# EAGLE board Dashboard rev7 (EAGLE 9.6.2)
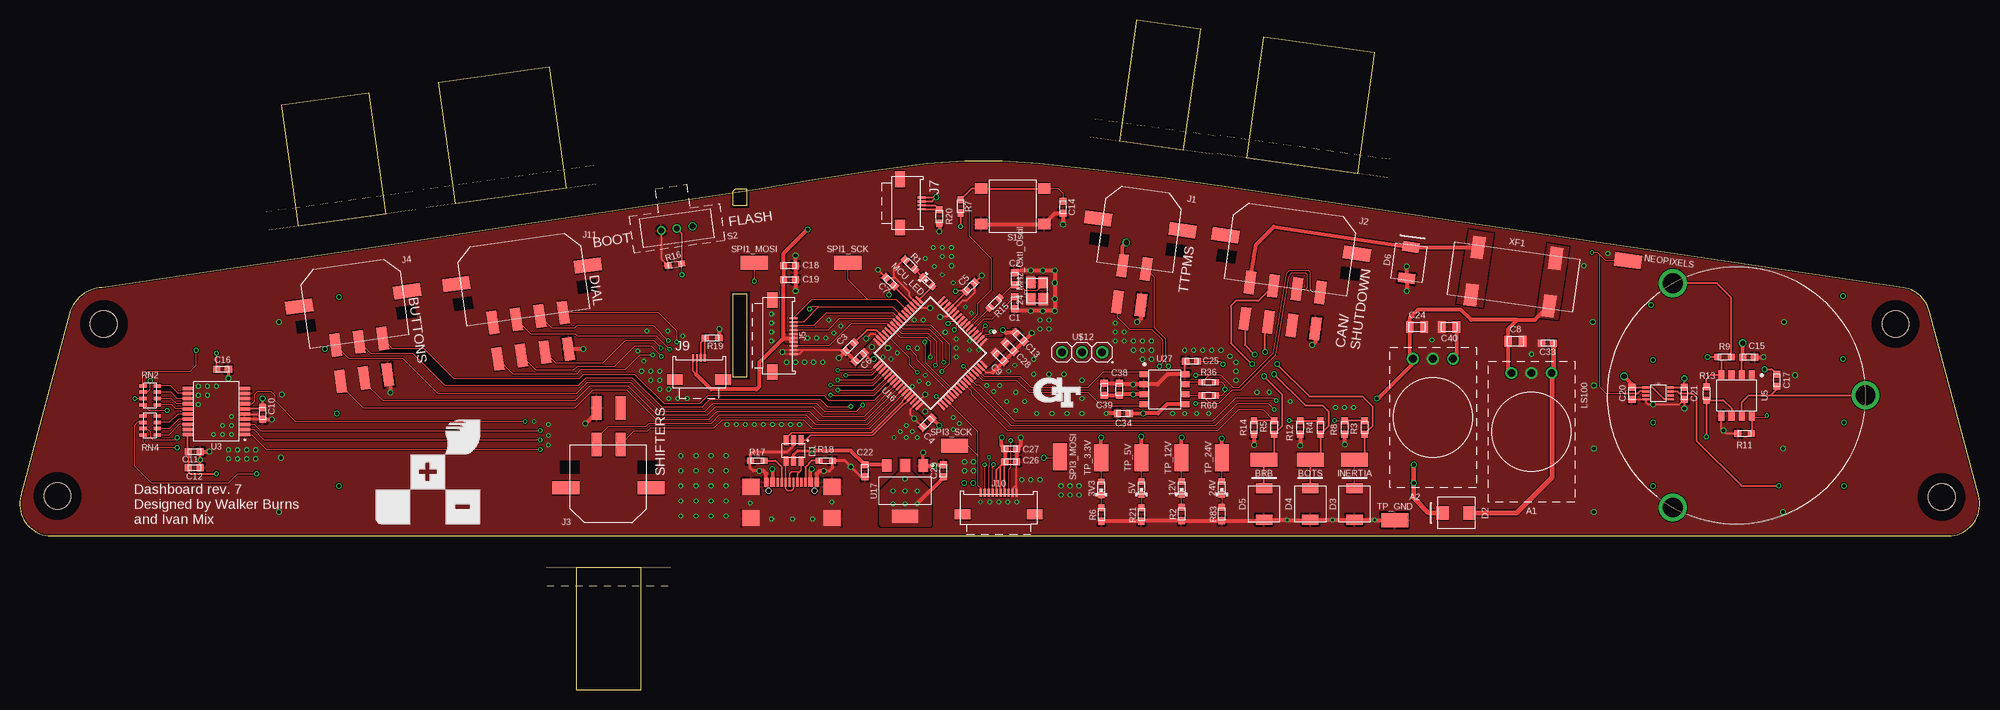
[diagram p5: board, top side]
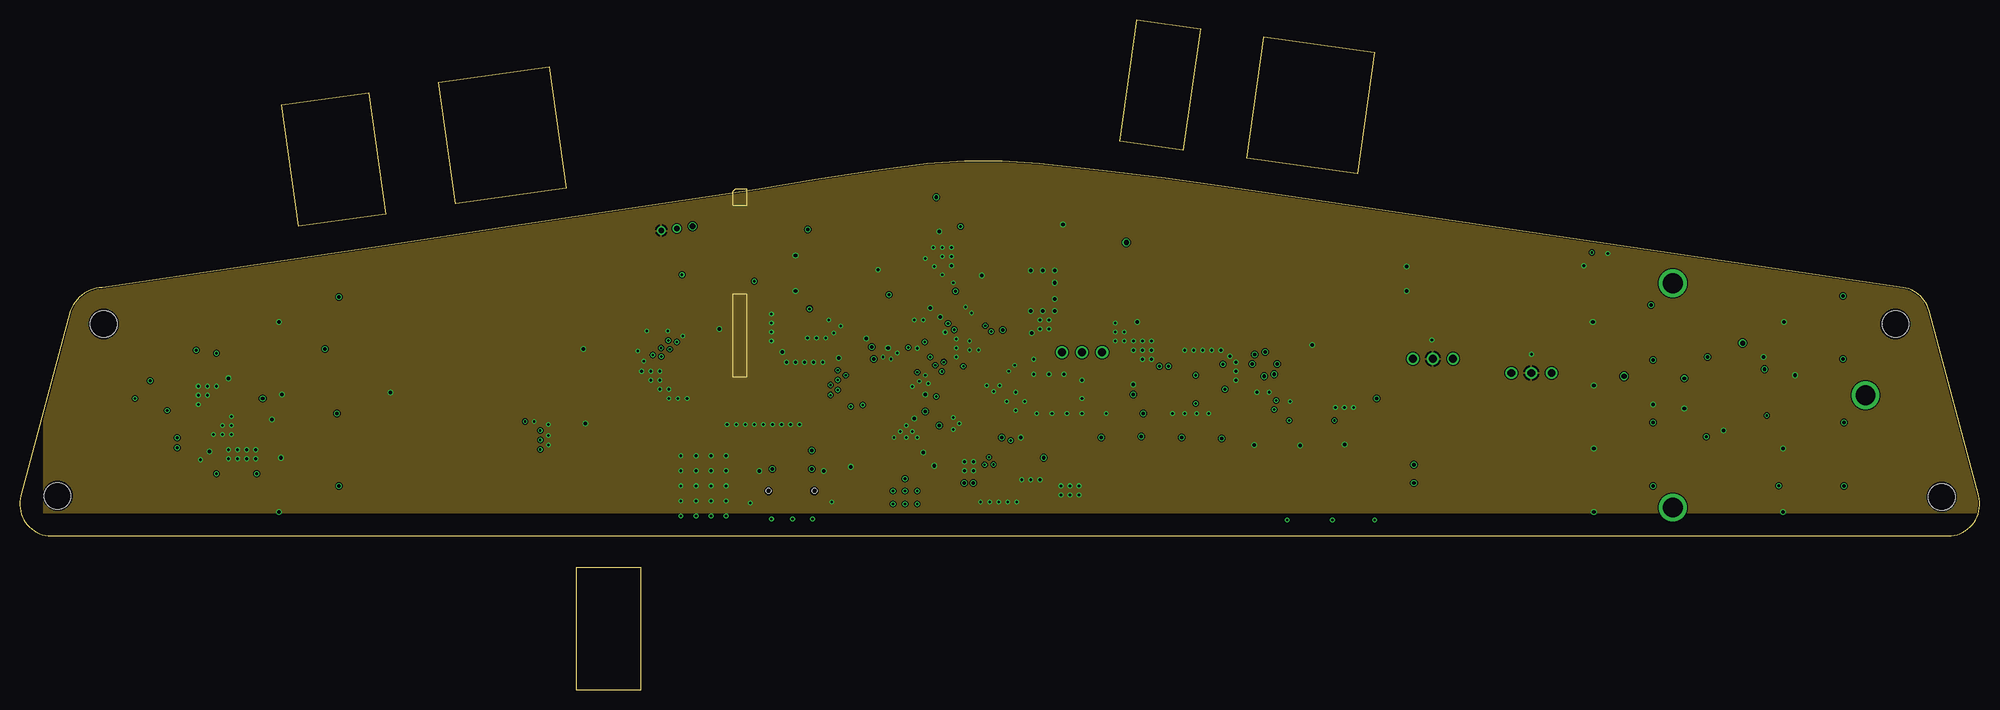
[diagram p6: board, inner layer Route2]
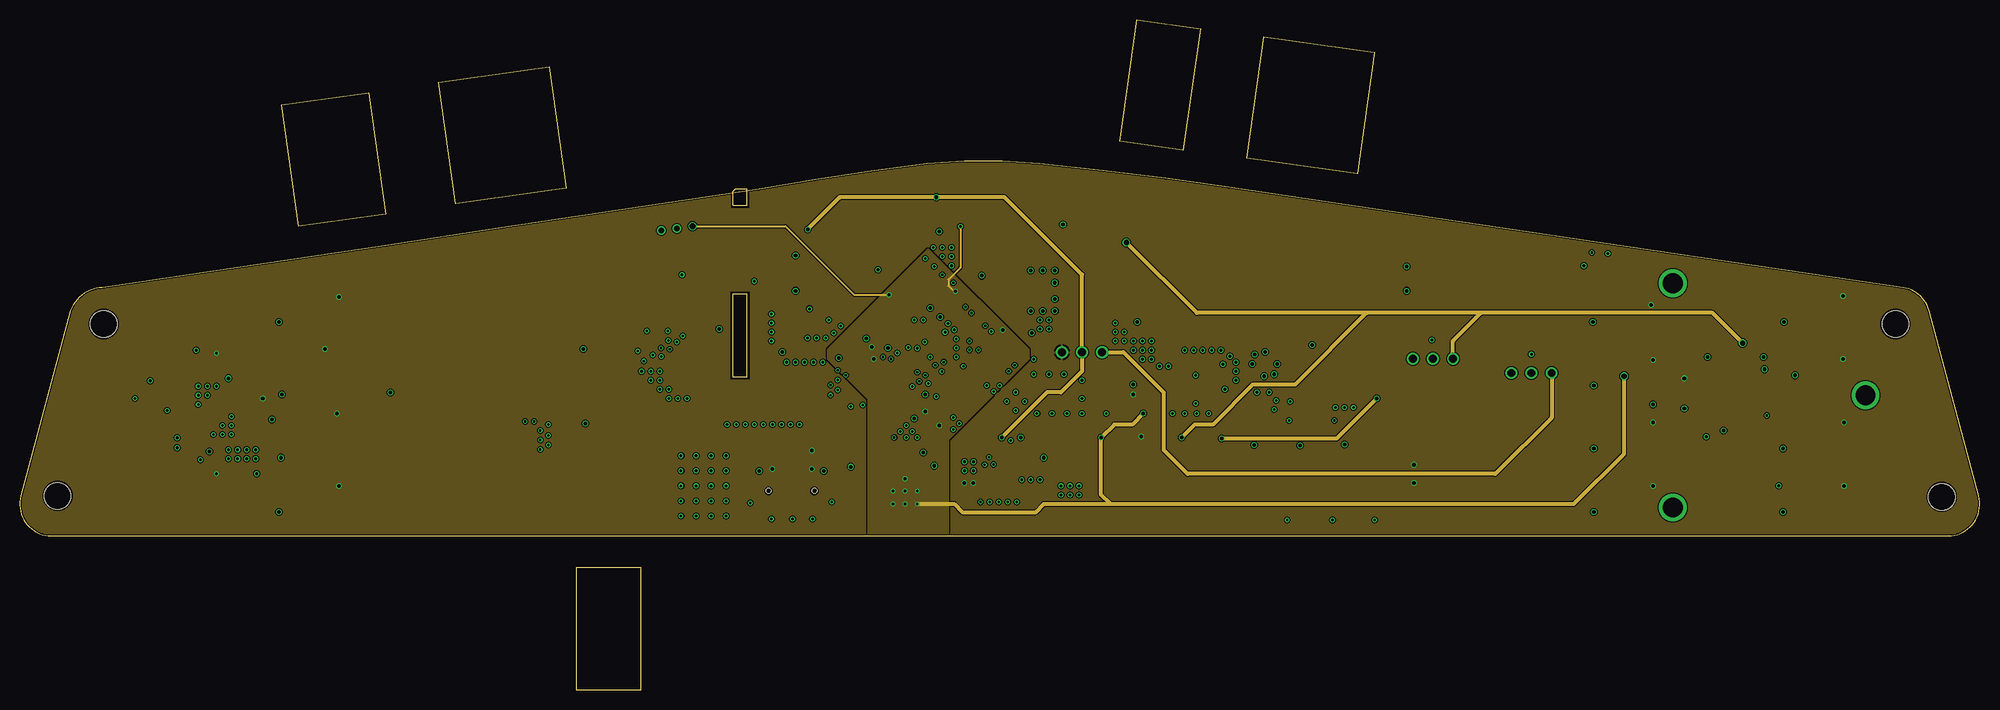
[diagram p7: board, inner layer Route15]
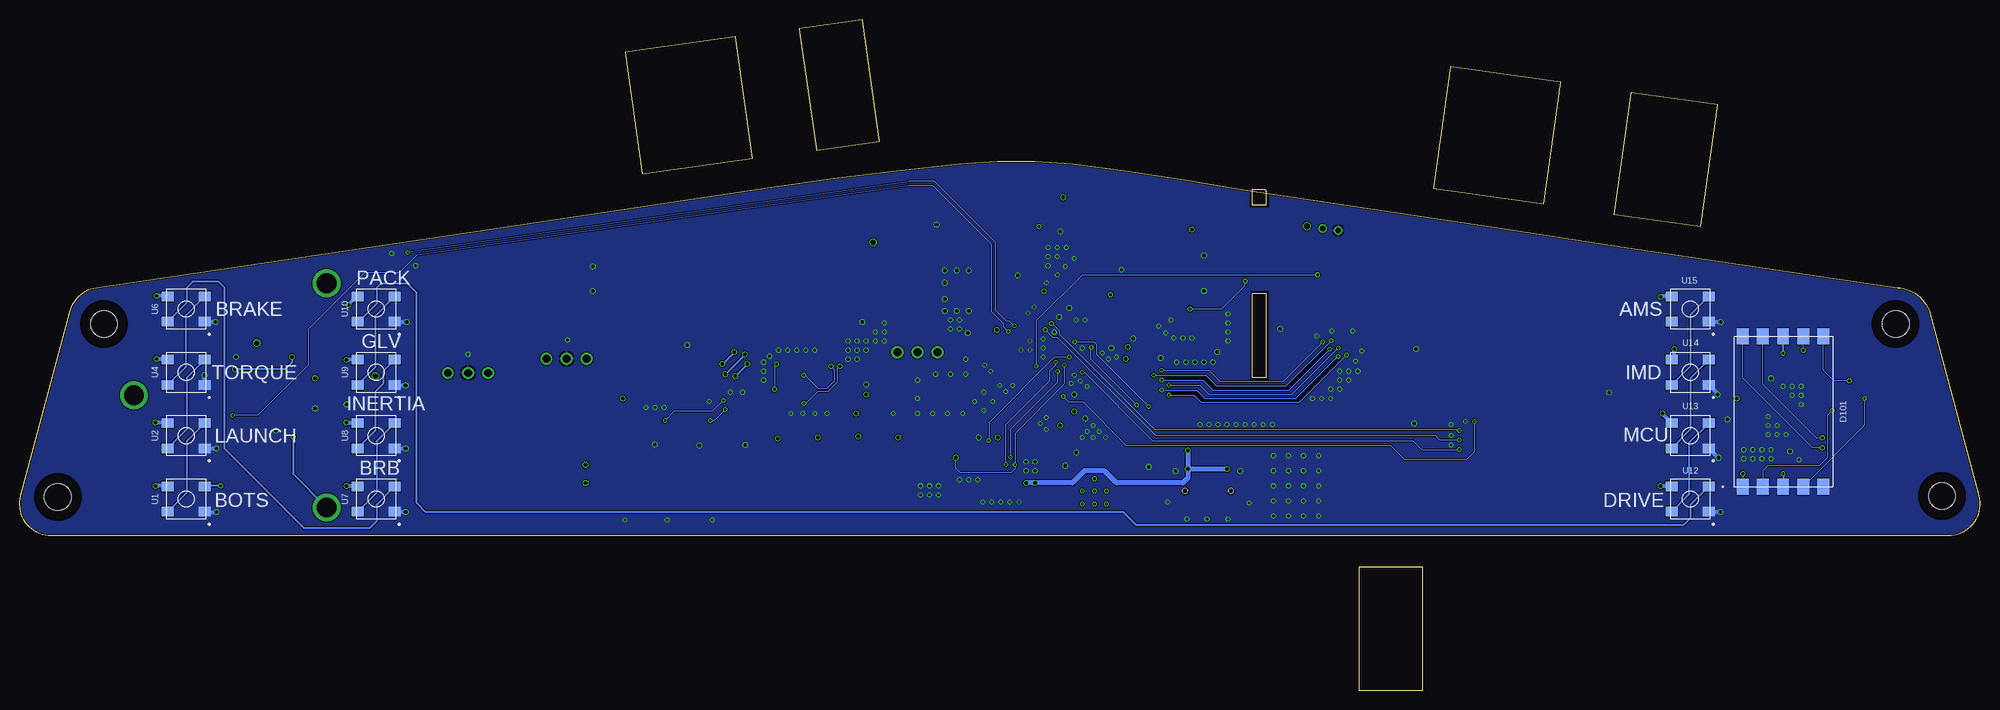
[diagram p8: board, bottom side, seen from below]

Size 247.57 x 47.33 mm. Coordinates in mm from the lower left corner, seen from the top.
Outline: 46.18,36.66 10.44,31.35 arc67 6.4,28.43 0.13,5.04 arc105 4,0 243.57,0 arc105 247.44,5.04 241.17,28.43 arc67 237.89,31.35 202.15,36.66 185.18,39.18 152.68,44.01 arc3 128.83,47.01 arc12 114.62,47 arc3 93.37,43.76 60.87,38.93 46.18,36.66
Copper layers (1+2*15+16): Top 0.035mm / dielectric 0.2mm / Route2 0.0175mm / dielectric 1.065mm / Route15 0.0175mm / dielectric 0.2mm / Bottom 0.035mm
Design rules "JLCPCB (4 Layer)": minimum track width 5mil, minimum drill 0.2mm, track to track 5mil, track to pad 5mil, pad to pad 5mil, via to via 20mil, smd to smd 5mil, copper to edge 0.2mm, drill to drill 21mil, minimum pad ring 6mil, minimum via ring 5mil, stop-mask expansion 2mil, vias tented up to drill 30mil, thermal gap 10mil
Milling: 9 lines

## Footprints (pad centres in the part's own frame; a part is rotated, then mirrored left to right if it is on the bottom)
0603-LED = smd 0.8 x 0.8: 1 -0.825,0; 2 0.825,0
OKI-78SR(HORIZONTAL) = drill 1: 1 2.54,-7.399; 2 0,-7.399; 3 -2.54,-7.399
5015 = smd 3.429 x 1.778: 1 0,0
0603-CAP = smd 0.9 x 0.9: 1 -0.75,0; 2 0.75,0
0805-CAP = smd 0.95 x 1.4: 1 -0.925,0; 2 0.925,0
SOT-23-6 = smd 0.62 x 1.22: 1 -0.95,-1.31; 2 0,-1.31; 3 0.95,-1.31; 4 0.95,1.31; 5 0,1.31; 6 -0.95,1.31
DO-214BA = smd 1.52 x 1.68: 1 -1.7,0; 2 1.7,0
DO-214AA = smd 1.27 x 2.1: 1 -1.98,0; 2 1.98,0
DSM7T = smd 1.5 x 2: 1 -5.08,-9.5; 2 -2.54,-9.5; 3 0,-9.5; 4 2.54,-9.5; 5 5.08,-9.5; 6 5.08,9.5; 7 2.54,9.5; 8 0,9.5; 9 -2.54,9.5; 10 -5.08,9.5
MOLEX_MICROFIT_SMD_RIGHTANGLE_04_DUAL = smd 1.27 x 2.921: 1 1.5,5.474; 2 -1.5,5.474; 3 1.5,10.097; 4 -1.5,10.097 | smd 3.429 x 1.651: PAD1 5.386,0; PAD2 -5.386,0
MOLEX_MICROFIT_SMD_RIGHTANGLE_08_DUAL = smd 1.27 x 2.921: 1 4.5,5.474; 2 1.5,5.474; 3 -1.5,5.474; 4 -4.5,5.474; 5 4.5,10.097; 6 1.5,10.097; 7 -1.5,10.097; 8 -4.5,10.097 | smd 3.429 x 1.651: PAD1 8.386,0; PAD2 -8.386,0
MOLEX_MICROFIT_SMD_RIGHTANGLE_06_DUAL = smd 1.27 x 2.921: 1 3,5.474; 2 0,5.474; 3 -3,5.474; 4 3,10.097; 5 0,10.097; 6 -3,10.097 | smd 3.429 x 1.651: PAD1 6.886,0; PAD2 -6.886,0
5051101092 = smd 2 x 1.3: 1 -4.55,-0.65; 2 4.55,-0.65 | smd 0.3 x 1: 3 -2.25,2.05; 4 -1.75,2.05; 5 -1.25,2.05; 6 -0.75,2.05; 7 -0.25,2.05; 8 0.25,2.05; 9 0.75,2.05; 10 1.25,2.05; 11 1.75,2.05; 12 2.25,2.05
5051100492 = smd 0.3 x 1: 1 -0.75,2.05; 2 -0.25,2.05; 3 0.25,2.05; 4 0.75,2.05 | smd 2 x 1.3: P1 -3.05,-0.65; P2 3.05,-0.65
USB4110 = smd 0.6 x 1.15: P$1 -3.2,0.6; P$2 -2.4,0.6; P$11 2.4,0.6; P$12 3.2,0.6 | smd 0.3 x 1.15: P$3 -1.75,0.6; P$4 -1.25,0.6; P$5 -0.75,0.6; P$6 -0.25,0.6; P$7 0.25,0.6; P$8 0.75,0.6; P$9 1.25,0.6; P$10 1.75,0.6 | smd 2.18 x 2: S$1 -5.11,0; S$2 5.11,0; S$3 -5.11,-3.93; S$4 5.11,-3.93 | hole 0.65: -2.89,-0.5; 2.89,-0.5
CPT-3011C-120 = drill 2.5: F 14.162,8.051; G -14.162,8.051; M 0,-16.29
0603-RES = smd 0.9 x 0.8: 1 -0.85,0; 2 0.85,0
1206-RES-ARRAY = smd 0.45 x 0.9: 1 -1.2,-0.9; 2 -0.4,-0.9; 3 0.4,-0.9; 4 1.2,-0.9; 5 1.2,0.9; 6 0.4,0.9; 7 -0.4,0.9; 8 -1.2,0.9
B3S-100X = smd 1.55 x 1.3: 1 3.975,-2.25; 2 -3.975,-2.25; 3 3.975,2.25; 4 -3.975,2.25
SSSS916400 = drill 0.7: 1 -2,0; 2 2,0; COM 0,0
NEOPIXEL = smd 1.5 x 1.2: 1 -2.35,1.6; 2 -2.35,-1.6; 3 2.35,-1.6; 4 2.35,1.6
SSOP-20 = smd 0.45 x 1.37: 1 -2.925,-3.6; 2 -2.275,-3.6; 3 -1.625,-3.6; 4 -0.975,-3.6; 5 -0.325,-3.6; 6 0.325,-3.6; 7 0.975,-3.6; 8 1.625,-3.6; 9 2.275,-3.6; 10 2.925,-3.6; 11 2.925,3.6; 12 2.275,3.6; 13 1.625,3.6; 14 0.975,3.6; 15 0.325,3.6; 16 -0.325,3.6; 17 -0.975,3.6; 18 -1.625,3.6; 19 -2.275,3.6; 20 -2.925,3.6
SOIC-08(NARROW,0.15") = smd 0.762 x 1.143: 1 -1.905,-2.603; 2 -0.635,-2.603; 3 0.635,-2.603; 4 1.905,-2.603; 5 1.905,2.603; 6 0.635,2.603; 7 -0.635,2.603; 8 -1.905,2.603
STM32-FOOTPRINT = smd 0.3 x 1.2: P$1 -3.75,-5.75; P$2 -3.25,-5.75; P$3 -2.75,-5.75; P$4 -2.25,-5.75; P$5 -1.75,-5.75; P$6 -1.25,-5.75; P$7 -0.75,-5.75; P$8 -0.25,-5.75; P$9 0.25,-5.75; P$10 0.75,-5.75; P$11 1.25,-5.75; P$12 1.75,-5.75; P$13 2.25,-5.75; P$14 2.75,-5.75; P$15 3.25,-5.75; P$16 3.75,-5.75; P$33 3.75,5.75; P$34 3.25,5.75; P$35 2.75,5.75; P$36 2.25,5.75; P$37 1.75,5.75; P$38 1.25,5.75; P$39 0.75,5.75; P$40 0.25,5.75; P$41 -0.25,5.75; P$42 -0.75,5.75; P$43 -1.25,5.75; P$44 -1.75,5.75; P$45 -2.25,5.75; P$46 -2.75,5.75; P$47 -3.25,5.75; P$48 -3.75,5.75 | smd 1.2 x 0.3: P$17 5.75,-3.75; P$18 5.75,-3.25; P$19 5.75,-2.75; P$20 5.75,-2.25; P$21 5.75,-1.75; P$22 5.75,-1.25; P$23 5.75,-0.75; P$24 5.75,-0.25; P$25 5.75,0.25; P$26 5.75,0.75; P$27 5.75,1.25; P$28 5.75,1.75; P$29 5.75,2.25; P$30 5.75,2.75; P$31 5.75,3.25; P$32 5.75,3.75; P$49 -5.75,3.75; P$50 -5.75,3.25; P$51 -5.75,2.75; P$52 -5.75,2.25; P$53 -5.75,1.75; P$54 -5.75,1.25; P$55 -5.75,0.75; P$56 -5.75,0.25; P$57 -5.75,-0.25; P$58 -5.75,-0.75; P$59 -5.75,-1.25; P$60 -5.75,-1.75; P$61 -5.75,-2.25; P$62 -5.75,-2.75; P$63 -5.75,-3.25; P$64 -5.75,-3.75
SOT-223 = smd 1.2 x 1.6: 1 -2.3,-3.2; 2 0,-3.2; 3 2.3,-3.2 | smd 3.3 x 1.6: 4 0,3.2
8-VSSOP = smd 0.85 x 0.3: 1 -1.55,0.75; 2 -1.55,0.25; 3 -1.55,-0.25; 4 -1.55,-0.75; 5 1.55,-0.75; 6 1.55,-0.25; 7 1.55,0.25; 8 1.55,0.75
MOUNTING_M3 = hole 3.4: 0,0
1X03 = drill 1.016: 1 1.27,-1.27; 2 3.81,-1.27; 3 6.35,-1.27
24_MHZ_XTAL_OSCILLATOR = smd 1.5 x 1.2: 1 -1.05,0.8; 2 1.05,0.8; 3 1.05,-0.8; 4 -1.05,-0.8
3588 = smd 1.575 x 2.819: 1 -4.953,3.035; 2 -4.953,-3.035; 3 4.953,-3.035; 4 4.953,3.035

## Placement (x,y rotation side)
3V3  LED_0603_GREEN_2V2  [0603-LED]  136.6,6 90 top
5V  LED_0603_BLUE  [0603-LED]  141.68,6.06 90 top
12V  LED_0603_RED  [0603-LED]  146.76,6.06 90 top
24V  LED_0603_ORANGE  [0603-LED]  151.84,6.06 90 top
A1  VOLTAGE_REGULATOR_MODULE__5V  [OKI-78SR(HORIZONTAL)]  190.96,13.17 180 top
A2  VOLTAGE_REGULATOR_MODULE__12V  [OKI-78SR(HORIZONTAL)]  178.51,14.95 180 top
BOTS  TEST_POINT  [5015]  163.02,9.61 0 top
BRB  TEST_POINT  [5015]  157.17,9.61 0 top
C1  CAPACITOR_0603_10V_15PF  [0603-CAP]  125.68,29.42 270 top
C2  CAPACITOR_0603_10V_15PF  [0603-CAP]  125.68,32.47 90 top
C3  CAPACITOR_0603_10V_4.7UF  [0603-CAP]  104.85,23.84 225 top
C4  CAPACITOR_0603_10V_0.1UF  [0603-CAP]  114.63,14.31 225 top
C5  CAPACITOR_0603_10V_0.1UF  [0603-CAP]  120.09,31.45 45 top
C6  CAPACITOR_0603_10V_0.1UF  [0603-CAP]  106.12,22.56 225 top
C7  CAPACITOR_0603_10V_0.1UF  [0603-CAP]  109.93,32.09 135 top
C8  CAPACITOR_0805_50V_10UF  [0805-CAP]  188.92,24.6 0 top
C9  CAPACITOR_0603_10V_0.1UF  [0603-CAP]  123.77,22.56 315 top
C10  CAPACITOR_0603_10V_0.1UF  [0603-CAP]  30.68,15.45 270 top
C11  CAPACITOR_0603_10V_0.1UF  [0603-CAP]  22.05,10.63 0 top
C12  CAPACITOR_0603_10V_0.1UF  [0603-CAP]  22.05,8.59 0 top
C13  CAPACITOR_0603_10V_1UF  [0603-CAP]  126.31,25.11 315 top
C14  CAPACITOR_0603_10V_0.1UF  [0603-CAP]  131.77,41.49 270 top
C15  CAPACITOR_0603_25V_0.1UF  [0603-CAP]  218.39,22.56 180 top
C16  CAPACITOR_0603_10V_0.1UF  [0603-CAP]  25.6,21.04 0 top
C17  CAPACITOR_0603_25V_1.2NF  [0603-CAP]  221.94,19.64 90 top
C18  CAPACITOR_0603_10V_0.1UF  [0603-CAP]  97.23,34.12 0 top
C19  CAPACITOR_0603_10V_0.1UF  [0603-CAP]  97.23,32.34 0 top
C20  CAPACITOR_0603_10V_0.1UF  [0603-CAP]  203.66,17.99 90 top
C21  CAPACITOR_0603_10V_0.1UF  [0603-CAP]  210.26,17.99 270 top
C22  CAPACITOR_0603_10V_4.7UF  [0603-CAP]  106.75,8.21 270 top
C24  CAPACITOR_0805_50V_10UF  [0805-CAP]  176.48,26.38 0 top
C25  CAPACITOR_0603_10V_4.7NF  [0603-CAP]  148.03,22.06 0 top
C26  CAPACITOR_0603_10V_0.1UF  [0603-CAP]  125.17,9.36 0 top
C27  CAPACITOR_0603_10V_0.1UF  [0603-CAP]  125.17,11.01 0 top
C28  CAPACITOR_0603_10V_0.1UF  [0603-CAP]  125.04,23.84 315 top
C29  CAPACITOR_0603_10V_4.7UF  [0603-CAP]  116.66,8.21 90 top
C33  CAPACITOR_0603_25V_10UF  [0603-CAP]  192.99,24.34 180 top
C34  CAPACITOR_0603_10V_0.1UF  [0603-CAP]  139.39,15.45 0 top
C38  CAPACITOR_0603_10V_0.1UF  [0603-CAP]  138.89,18.5 270 top
C39  CAPACITOR_0603_10V_1UF  [0603-CAP]  136.98,18.5 270 top
C40  CAPACITOR_0805_50V_10UF  [0805-CAP]  180.54,26.38 180 top
D1  USBLC6-2SC6  [SOT-23-6]  97.74,10.75 180 top
D2  SCHOTTKY__15V  [DO-214BA]  181.43,2.88 180 top
D3  TVS_DO-214AA_30V  [DO-214AA]  168.6,4.02 90 top
D4  TVS_DO-214AA_30V  [DO-214AA]  163.02,4.02 90 top
D5  TVS_DO-214AA_30V  [DO-214AA]  157.17,4.02 90 top
D6  TVS_DO-214AA_30V  [DO-214AA]  175.46,34.5 82 top
D101  LED_7_SEGMENT_BLUE_DSM7TA  [DSM7T]  24.84,15.71 0 bottom
INERTIA  TEST_POINT  [5015]  168.6,9.61 0 top
J1  CONNECTOR-4_μF_S_RA_  [MOLEX_MICROFIT_SMD_RIGHTANGLE_04_DUAL]  141.55,39.33 172 top
J2  CONNECTOR-8_μF_S_RA_  [MOLEX_MICROFIT_SMD_RIGHTANGLE_08_DUAL]  160.6,36.79 172 top
J3  CONNECTOR-4_μF_S_RA_  [MOLEX_MICROFIT_SMD_RIGHTANGLE_04_DUAL]  74.37,6.06 0 top
J4  CONNECTOR-6_μF_S_RA_  [MOLEX_MICROFIT_SMD_RIGHTANGLE_06_DUAL]  42.11,29.93 188 top
J5  CONNECTOR-10__  [5051101092]  95.71,25.23 270 top
J7  CONNECTOR-4_FD19_0492_  [5051100492]  111.83,42 270 top
J8  USB4110  [USB4110]  97.48,6.18 0 top
J9  CONNECTOR-4_FD19_0492_  [5051100492]  85.8,20.41 0 top
J10  CONNECTOR-10__  [5051101092]  123.65,3.39 0 top
J11  CONNECTOR-8_μF_S_RA_  [MOLEX_MICROFIT_SMD_RIGHTANGLE_08_DUAL]  63.45,32.98 188 top
LS100  BUZZER_3_PIN_CPT-3011C-120  [CPT-3011C-120]  216.86,17.74 90 top
MCU_LED  LED_0603_GREEN_2V2  [0603-LED]  114.68,32.09 315 top
NEOPIXELS  TEST_POINT  [5015]  203.15,34.76 352 top
R1  RESISTOR_0603_240  [0603-RES]  112.47,34.25 315 top
R2  RESISTOR_0603_1K  [0603-RES]  146.76,2.75 90 top
R3  RESISTOR_0603_41.2K  [0603-RES]  169.87,13.67 90 top
R4  RESISTOR_0603_41.2K  [0603-RES]  164.29,13.67 90 top
R5  RESISTOR_0603_41.2K  [0603-RES]  158.44,13.67 90 top
R6  RESISTOR_0603_240  [0603-RES]  136.63,2.68 90 top
R7  RESISTOR_0603_10K  [0603-RES]  118.82,41.62 270 top
R8  RESISTOR_0603_5.1K  [0603-RES]  167.33,13.67 270 top
R9  RESISTOR_0603_150K  [0603-RES]  215.34,22.56 0 top
R11  RESISTOR_0603_10K  [0603-RES]  217.88,12.91 0 top
R12  RESISTOR_0603_5.1K  [0603-RES]  161.75,13.67 270 top
R13  RESISTOR_0603_1.5M  [0603-RES]  213.05,17.99 90 top
R14  RESISTOR_0603_5.1K  [0603-RES]  155.9,13.67 270 top
R15  RESISTOR_0603_0  [0603-RES]  123.14,29.42 225 top
R16  RESISTOR_0603_10K  [0603-RES]  82.75,34.25 8 top
R17  RESISTOR_0603_5.1K  [0603-RES]  93.17,9.48 0 top
R18  RESISTOR_0603_5.1K  [0603-RES]  101.8,9.48 180 top
R19  RESISTOR_0603_30  [0603-RES]  87.45,24.98 180 top
R20  RESISTOR_0603_30  [0603-RES]  116.15,40.34 90 top
R21  RESISTOR_0603_180  [0603-RES]  141.68,2.68 90 top
R36  RESISTOR_0603_60.4  [0603-RES]  150.19,19.39 180 top
R60  RESISTOR_0603_60.4  [0603-RES]  150.19,17.74 180 top
R83  RESISTOR_0603_3.3K  [0603-RES]  151.84,2.75 90 top
RN2  RESISTOR_NETWORK_4_160  [1206-RES-ARRAY]  16.46,17.74 90 top
RN4  RESISTOR_NETWORK_4_160  [1206-RES-ARRAY]  16.46,13.93 90 top
S1  BUTTON  [B3S-100X]  125.42,41.62 180 top
S2  SWITCH_SPDT_SSSS916400  [SSSS916400]  83.01,38.82 188 top
SPI1_MOSI  TEST_POINT  [5015]  92.78,34.5 0 top
SPI1_SCK  TEST_POINT  [5015]  104.6,34.5 0 top
SPI3_MOSI  TEST_POINT  [5015]  131.39,9.99 270 top
SPI3_SCK  TEST_POINT  [5015]  118.06,11.39 0 top
TP_3.3V  TEST_POINT  [5015]  136.6,9.86 90 top
TP_5V  TEST_POINT  [5015]  141.68,9.86 90 top
TP_12V  TEST_POINT  [5015]  146.76,9.86 90 top
TP_24V  TEST_POINT  [5015]  151.84,9.86 90 top
TP_GND  TEST_POINT  [5015]  173.68,1.99 0 top
U1  NEOPIXEL_IN-PI55QATPRPGPBPW-40  [NEOPIXEL]  226.56,4.65 0 bottom
U2  NEOPIXEL_IN-PI55QATPRPGPBPW-40  [NEOPIXEL]  226.56,12.65 0 bottom
U3  MCP23S08  [SSOP-20]  24.84,15.71 90 top
U4  NEOPIXEL_IN-PI55QATPRPGPBPW-40  [NEOPIXEL]  226.56,20.65 0 bottom
U5  RE46C100  [SOIC-08(NARROW,0.15")]  216.86,17.74 180 top
U6  NEOPIXEL_IN-PI55QATPRPGPBPW-40  [NEOPIXEL]  226.56,28.65 0 bottom
U7  NEOPIXEL_IN-PI55QATPRPGPBPW-40  [NEOPIXEL]  202.56,4.65 0 bottom
U8  NEOPIXEL_IN-PI55QATPRPGPBPW-40  [NEOPIXEL]  202.56,12.65 0 bottom
U9  NEOPIXEL_IN-PI55QATPRPGPBPW-40  [NEOPIXEL]  202.56,20.65 0 bottom
U10  NEOPIXEL_IN-PI55QATPRPGPBPW-40  [NEOPIXEL]  202.56,28.65 0 bottom
U12  NEOPIXEL_IN-PI55QATPRPGPBPW-40  [NEOPIXEL]  36.56,4.65 0 bottom
U13  NEOPIXEL_IN-PI55QATPRPGPBPW-40  [NEOPIXEL]  36.56,12.65 0 bottom
U14  NEOPIXEL_IN-PI55QATPRPGPBPW-40  [NEOPIXEL]  36.56,20.65 0 bottom
U15  NEOPIXEL_IN-PI55QATPRPGPBPW-40  [NEOPIXEL]  36.56,28.65 0 bottom
U16  STM32-LQFP64  [STM32-FOOTPRINT]  115.01,23.07 135 top
U17  VOLTAGE_REGULATOR_SOT-223_3.3V  [SOT-223]  111.83,5.67 180 top
U27  TCAN1051HQV-Q1  [SOIC-08(NARROW,0.15")]  144.6,18.5 270 top
U$5  [LOGO_HYTECH_SQUARE_EXTRA_LARGE]  51.51,8.09 0 top
U$6  SN74LXC2T45DCUR  [8-VSSOP]  206.96,17.99 0 top
U$7  [LOGO_GT_SMALL]  131.01,18.12 0 top
U$8  [MOUNTING_M3]  242.77,4.91 0 top
U$9  [MOUNTING_M3]  10.62,26.76 0 top
U$10  [MOUNTING_M3]  236.93,26.76 0 top
U$11  [MOUNTING_M3]  4.77,5.04 0 top
U$12  JUMPER_3PIN  [1X03]  138,21.93 180 top
X1  24_MHZ_XTAL_OSCILLATOR  [24_MHZ_XTAL_OSCILLATOR]  128.47,30.95 90 top
XF1  FUSE_HOLDER_MINIBLADESMD  [3588]  188.67,32.73 352 top

## Tracks (layer width: path | path; a pad name or v marks a point on that pad's centre or on a via)
5V_IN
  Top 0.635: C33.1 193.74,20.81 A1.3 193.5,7.33 189.05,2.88 D2.1
  Route15 0.508: A1.3 193.5,14.95 186.38,7.83 147.52,7.83 144.47,10.88 144.47,18.12 139.39,23.2 U$12.1
7SEG_LOAD  (via drill 0.3)
  Top 0.152: U3.7 29.37,16.68 29.67,16.98 29.67,17.87 30.05,18.25 31.7,18.25 32.21,17.74 32.21,17.1 34.87,14.44 v63.83,14.44 | v115.77,17.61 116.67,16.71 U16.P$50
  Bottom 0.152: v115.77,17.61 115.01,16.85 113.23,16.85 107.77,11.39 74.37,11.39 72.59,9.61 64.84,9.61 63.83,10.63 v63.83,14.44
24VIN
  Top 0.508: J2.1 156.15,36.78 158.41,39.04 D6.2 184.14,36.46 XF1.1
  pour Top (no thermals): 181.81,30.57 183.08,38.69 186.13,38.19 184.73,28.79 181.56,29.3
+3V3  (via drill 0.35, 0.45, 0.65)
  Top 0.152: TP_3.3V.1 3V3.2
  Top 0.254: C6.1 107.42,22.32 v107.89,22.32 | U16.P$19 110.46,31.51 C7.1 110.42,31.56 109.8,30.95 v109.8,30.44 | U16.P$13 119.56,30.8 C5.1 118.23,30.92 v118.18,30.88 | U$6.5 207.71,17.24 206.2,18.75 205.42,18.75 U$6.1 C20.2 | R7.2 v118.82,39.08
  Top 0.508: C4.1 115.24,14.84 v116.15,13.93 | C20.2 203.64,18.75 203.64,19.14 203.66,19.15 v202.66,20.15 | TP_3.3V.1 v136.6,12.41 | U27.5 144.92,16.6 143.78,15.45 v141.93,15.45 C34.2 | C13.1 124.51,25.63 v124.15,25.99 | C29.1 116.66,7.33 v113.36,4.02
  Route15 0.254: S2.1 96.72,39.1 105.38,30.44 v109.8,30.44 | v118.82,39.08 118.82,33.87 117.3,32.34 117.3,31.58 118,30.88 v118.18,30.88
  Route15 0.508: v113.36,4.02 118.06,4.02 119.07,3.01 128.34,3.01 129.36,4.02 137.74,4.02 | 137.74,4.02 196.29,4.02 202.66,10.39 v202.66,20.15 | 137.74,4.02 136.6,5.17 v136.6,12.41 138.25,14.06 140.54,14.06 v141.93,15.45
  other vias: 110.31,5.67 111.83,5.67 111.83,7.2 111.83,4.02 110.31,4.02 114.37,15.71 107.64,23.84 113.36,5.67
  pour Top (no thermals): 111.07,9.74 111.07,8.09 108.53,5.55 108.53,1.48 108.79,1.23 115.01,1.23 115.14,1.36 115.14,5.55 112.6,8.09 112.6,9.74
  pour Route15: 107.14,-5.63 107.14,17.23 102.06,22.31 102.06,23.58 114.76,36.28 127.46,23.58 127.46,22.31 117.3,12.15 117.3,-5.63
  pour Top (no thermals): 113.99,16.72 115.77,14.95 115.77,14.82 115.26,14.31 115.14,14.31 113.49,15.96 113.23,15.96
  pour Top (no thermals): 107.9,24.85 106.12,23.07 106.63,22.56 107.14,22.56 108.66,24.09
  pour Top (no thermals): 121.87,23.45 121.23,24.09 122.12,24.98 124.28,24.98 125.55,26.25 125.93,26.25 126.44,25.74 126.44,25.49 122.12,21.17 121.36,21.93 121.36,22.06 121.87,22.56
+5V  (via drill 0.35, 0.45)
  Top 0.152: 24.85,23.06 v24.84,23.07 | C11.1 21.24,10.68 | C10.1 30.51,16.03 | 5V.2 TP_5V.1
  Top 0.254: C16.1 24.85,23.06 | C11.1 C12.1 21.3,8.09 21.55,7.83 v24.84,7.83 | 21.24,10.68 U3.20 | 30.51,16.03 U3.6 | U$6.8 C21.1 v210.26,19.9
  Top 0.381: C10.1 v30.68,17.36 | D1.5 97.74,10.25 98.25,10.75 v100.02,10.75
  Top 0.508: v95.07,8.47 95.08,8.45 J8.P$2 | J8.P$11 99.88,8.33 v100.02,8.47 | TP_5V.1 v141.68,12.53 | U27.3 v140.66,17.87 139,17.87 C38.2 C39.2 | v100.02,10.75 104.96,10.75 C22.1 109.44,8.96 U17.3
  Top 0.635: D2.2 178,2.88 176.1,4.78 v176.1,6.69 v176.1,8.98
  Bottom 0.254: v24.84,23.07 D101.8 | v24.84,7.83 D101.3
  Bottom 0.508: U6.1 228.97,30.31 v230.33,30.31 | U4.1 228.97,22.31 v230.33,22.31 | U2.1 228.96,14.31 v230.45,14.31 | U1.1 228.96,6.31 v230.45,6.31 | U8.1 206.26,14.25 v206.32,14.31 | U7.1 206.26,6.25 v206.32,6.31 | U9.1 206.26,22.25 v206.32,22.18 | U10.1 204.99,30.25 v206.07,29.17 | U12.1 40.28,6.25 v40.33,6.31 | U13.1 40.08,15.42 v40.08,15.45 | U14.1 38.56,22.6 v38.56,23.58 | U15.1 40.27,30.25 v40.33,30.19
  Bottom 0.635: v100.02,10.75 v100.02,8.47 | v100.02,8.47 v95.07,8.47 | v100.02,8.47 100.02,7.33 100.66,6.69 109.04,6.69 110.56,8.21 113.1,8.21 114.63,6.69 v119.33,6.69 v120.43,6.69
  pour Route15 (rank 2): -4.62,-5.63 251.92,-5.63 251.92,51.52 -4.62,51.52
  cutout Route15: 89.86,30.82 92.15,30.82 92.15,19.77 89.86,19.77
  cutout Route15: 89.86,44.16 89.86,41.49 92.15,41.49 92.15,44.16
+12V  (via drill 0.45, 0.65)
  Top 0.152: 12V.2 TP_12V.1
  Top 0.254: U5.2 217.5,22.43 C15.2
  Top 0.508: C40.1 181.47,22.76 A2.3 | J1.1 139.31,36.57 v139.77,37.04 | C15.2 217.63,22.58 v217.63,24.34 | TP_12V.1 v146.76,12.41
  Route15 0.508: 184.57,28.15 170.13,28.15 | 170.13,28.15 148.66,28.15 v139.77,37.04 | A2.3 181.05,24.63 184.57,28.15 | v217.63,24.34 213.82,28.15 184.57,28.15 | v146.76,12.41 148.41,14.06 150.7,14.06 155.78,19.14 161.11,19.14 170.13,28.15
+24V  (via drill 0.45)
  Top 0.152: 24V.2 TP_24V.1
  Top 0.508: A1.1 188,20.98 C8.1 188,26.09 189.18,27.26 | v171.4,17.36 171.62,17.36 175.97,21.71 A2.1 175.55,22.76 C24.1 175.55,27.48 176.6,28.53 182.07,28.53 183.34,27.26 189.18,27.26 | TP_24V.1 v151.84,12.28 | 189.18,27.26 191.39,27.26 XF1.3
  Route15 0.508: v171.4,17.36 166.32,12.28 v151.84,12.28
  pour Top (no thermals): 193.88,27.26 191.56,27.57 192.99,36.96 195.65,36.49 194.26,27.26
A  (via drill 0.35)
  Top 0.152: RN2.5 15.56,20.14 16.2,20.79 21.54,20.79 22.3,21.55 v22.3,23.45
  Bottom 0.152: v22.3,23.45 D101.7
A2
  Top 0.152: U3.12 20.02,17.98 19.07,18.94 RN2.4
B  (via drill 0.35)
  Top 0.152: RN2.6 16.1,18.14 16.46,18.5 v16.46,19.59
  Bottom 0.152: D101.6 19.76,20.89 18.46,19.59 v16.46,19.59
B2
  Top 0.152: U3.13 19.91,17.33 19.11,18.14 RN2.3
BOTS  (via drill 0.45)
  Top 0.254: D4.2 163.02,9.48 | 163.02,9.48 BOTS.1 | 163.02,9.48 163.52,9.48 164.29,10.25 R4.1 165.3,13.84 165.3,15.71 164.54,16.47 162.38,16.47 v158.44,20.41 | J2.5 154.74,24.11 v155.97,22.88
  Bottom 0.254: v155.97,22.88 v158.44,20.41
BOTS_READ  (via drill 0.3)
  Top 0.152: U16.P$58 125.21,13.94 151.03,13.94 153.81,16.72 157.69,16.72 v158.44,15.96 | v160.35,14.56 161.71,14.56 R12.1
  Top 0.254: R12.1 R4.2
  Bottom 0.152: v158.44,15.96 159.84,14.56 v160.35,14.56
BRB  (via drill 0.45)
  Top 0.254: D5.2 157.17,9.48 | 157.17,9.48 BRB.1 | 157.17,9.48 157.81,9.48 158.44,10.12 R5.1 159.46,13.84 159.46,17.87 v157.17,20.15 | J2.2 156.45,29.68 153.62,29.68 152.98,29.04 152.98,24.34 v155.65,21.68
  Bottom 0.254: v155.65,21.68 v157.17,20.15
BRB_READ
  Top 0.152: U16.P$57 120.14,18.3 120.14,17.91 124.75,13.31 151.36,13.31 154.02,15.96 157.01,15.96 R5.2
  Top 0.254: R5.2 R14.1
BTN_DIM_READ
  Top 0.152: U16.P$40 106.64,15.06 101.43,15.06 100.28,16.22 87.83,16.22 86.82,15.2 80.59,15.2 76.92,18.87 72,18.87 70.24,17.11 45.82,17.11 43.52,19.41 J4.5
BTN_MC_CYCLE_READ
  Top 0.152: J4.3 47.06,23.71 51.02,23.71 54.82,19.91 70.7,19.91 71.19,20.41 77.69,20.41 81.37,16.72 85.93,16.72 86.94,17.74 101.56,17.74 102.18,17.12 108,17.12 U16.P$39
BTN_MODE_READ  (via drill 0.3)
  Top 0.152: J4.2 44.31,23.07 49.61,23.07 53.67,19.02 70.58,19.02 71.46,19.9 77.43,19.9 81.11,16.22 86.18,16.22 87.2,17.23 101.11,17.23 102.01,16.33 v104.98,16.33 | U16.P$54 114.37,21.94 114.37,24.39 v114.3,24.47
  Bottom 0.152: v104.98,16.33 104.98,16.34 111.52,22.88 111.52,24.15 111.83,24.47 v114.3,24.47
BTN_PRESET_READ
  Top 0.152: U16.P$41 106.86,14.57 100.91,14.57 99.78,15.71 88.09,15.71 87.1,14.72 80.37,14.72 76.71,18.37 72.34,18.37 70.16,16.19 43.34,16.19 40.55,18.99 J4.4
BTN_START_READ  (via drill 0.3)
  Top 0.152: J4.1 41.56,22.44 48.33,22.44 52.77,18 70.33,18 71.72,19.39 77.16,19.39 80.85,15.71 86.56,15.71 87.58,16.72 100.66,16.72 101.73,15.65 105.61,15.65 v106.5,16.54 | U16.P$53 113.37,22.24 113.37,22.68 v112.24,23.81
  Bottom 0.152: v112.24,23.81 112.24,22.29 v106.5,16.54
BUZZER_CTRL  (via drill 0.3)
  Top 0.152: U16.P$2 122.01,25.48 122.41,25.48 v122.71,25.78 | v220.67,15.2 220.42,14.95 218.77,14.95
  Top 0.254: U5.8 218.77,14.95 218.77,12.95 R11.2
  Bottom 0.152: v122.71,25.78 123.28,26.35 123.28,26.74 124.91,28.38 124.91,36.92 132.27,44.28 135.29,44.28 197.38,35.49 199.58,33.3 203.97,33.3 211.15,26.12 211.15,21.55 217.5,15.2 v220.67,15.2
C  (via drill 0.35)
  Top 0.152: RN2.7 14.57,17.34 v14.55,17.36
  Bottom 0.152: v14.55,17.36 14.55,13.95 D101.4
C2
  Top 0.152: U3.14 19.8,16.68 19.14,17.34 RN2.2
CANH  (via drill 0.35)
  Top 0.152: U27.7 147.46,19.39 R36.2 150.23,20.28 | J2.4 163.35,30.74 162.94,31.15 162.94,33.36 162.76,33.54 160.4,33.54 160.08,33.22 160.03,32.91 158.36,23.12 154,18.75 153.24,18.75 151.71,20.28 150.23,20.28 | 150.23,20.28 v148.54,20.28 | v145.11,21.42 144.72,21.81 144.72,24.89 143.35,26.26 143.35,32.63 J1.2
  Bottom 0.152: v148.54,20.28 148.41,20.28 146.76,18.63 145.62,18.63 144.73,19.52 144.73,21.04 v145.11,21.42
CANL  (via drill 0.35)
  Top 0.152: 147.33,17.74 R60.2 150.35,16.72 | 150.35,16.72 151.46,16.72 153.19,18.45 154.25,18.45 158.68,22.87 160.29,32.66 160.6,33.23 162.38,33.23 162.63,32.98 162.63,31.33 162.38,31.07 161.41,31.07 J2.3 | 150.35,16.72 v148.54,16.72 | v143.95,21.42 144.34,21.81 144.34,24.73 143.01,26.06 140.24,26.06 138.66,27.63 J1.3
  Top 0.254: U27.6 147.33,17.74
  Bottom 0.152: v148.54,16.72 148.28,16.72 146.76,18.25 145.48,18.25 144.33,19.4 144.33,21.04 v143.95,21.42
D  (via drill 0.35)
  Top 0.152: RN2.8 16.26,15.83 v18.62,15.83
  Bottom 0.152: v18.62,15.83 19.25,15.2 19.25,9.86 20.27,8.85 26.74,8.85 27.38,8.21 D101.2
D2
  Top 0.152: U3.15 19.69,16.03 19.18,16.54 RN2.1
DIAL_AUTOCROSS  (via drill 0.3)
  Top 0.152: v79.97,22.83 78.32,22.83 76.44,20.95 70.85,20.95 70.31,20.41 62.34,20.41 J11.5 | v102.41,17.76 107.93,17.76 U16.P$38
  Bottom 0.152: v102.41,17.76 99.29,17.76 98.37,16.85 85.96,16.85 v79.97,22.83
DIAL_ENDURANCE  (via drill 0.3)
  Top 0.152: v83.01,24.47 83.01,25.86 80.68,28.19 J11.4 | U16.P$33 107.55,20.91 v103.33,20.91
  Bottom 0.152: v83.01,24.47 87.96,19.52 95.96,19.52 97.36,20.91 v103.33,20.91
DIAL_LAUNCH  (via drill 0.3)
  Top 0.152: v81.01,23.74 80.12,24.63 76.44,24.63 73.61,21.8 67.72,21.8 J11.7 | v102.41,19.03 107.79,19.03 U16.P$36
  Bottom 0.152: v102.41,19.03 98.52,19.03 97.36,17.87 86.88,17.87 v81.01,23.74
DIAL_MODE_1  (via drill 0.3)
  Top 0.152: U16.P$34 107.62,20.28 v104.34,20.28 | v81.92,24.65 80.07,26.5 70.31,26.5 70.05,26.25 67.21,26.25 J11.3
  Bottom 0.152: v104.34,20.28 104.31,20.25 97.72,20.25 96.41,18.94 87.63,18.94 v81.92,24.65
DIAL_MODE_2  (via drill 0.3)
  Top 0.152: v82.1,23.56 80.43,25.23 70.43,25.23 70.18,25.49 64.59,25.49 J11.2 | U16.P$35 107.72,19.67 v103.35,19.67
  Bottom 0.152: v103.35,19.67 98.14,19.67 96.85,18.37 87.28,18.37 v82.1,23.56
DIAL_SKIDPAD  (via drill 0.3)
  Top 0.152: v81.06,22.65 79.79,23.92 77.63,23.92 75.08,21.37 70.38,21.37 69.92,20.91 65.23,20.91 J11.6 | v103.35,18.4 107.86,18.4 U16.P$37
  Bottom 0.152: v103.35,18.4 98.9,18.4 97.86,17.36 86.36,17.36 v81.06,22.65
DISP_5V  (via drill 0.45)
  Top 0.254: J10.7 123.4,8.33 C26.1 | J10.8 123.9,8.83 C26.1 | J10.9 124.4,9.33 C26.1 | J7.1 115.76,42.75 | 115.76,42.75 v115.77,42.76 | J7.2 115.26,42.25 115.76,42.75 | J9.1 85.05,20.77 85.42,20.41 85.55,20.54 J9.2
  Top 0.508: C26.1 C27.1 124.03,11.4 v124.03,12.41 | v99.52,38.69 96.48,35.66 C18.1 C19.1 96.48,24.99 96.47,24.98 | 85.42,20.41 87.32,18.5 93.04,18.5 93.42,18.88 93.42,21.93 96.47,24.98 | 96.47,24.98 J5.8
  Route15 0.508: v124.03,12.41 129.74,18.12 131.52,18.12 134.19,20.79 U$12.2 134.19,32.98 124.41,42.76 v115.77,42.76 103.58,42.76 v99.52,38.69
  pour Top: 98.25,25.61 98.25,24.34 96.85,24.34 96.47,24.72 96.47,25.23 96.85,25.61
E  (via drill 0.35)
  Top 0.152: RN4.6 14.83,14.33 14.43,13.93 14.43,8.85 16.58,6.69 26.36,6.69 27.51,7.83 v29.92,7.83
  Bottom 0.152: v29.92,7.83 D101.1
E2
  Top 0.152: U3.16 19.94,15.38 18.89,14.33 RN4.3
F  (via drill 0.35)
  Top 0.152: RN4.7 16.1,13.53 16.46,13.17 16.46,12.5 16.81,12.15 19.63,12.15 v19.89,12.41
  Bottom 0.152: v19.89,12.41 20.65,12.41 27.38,19.14 D101.9
F2
  Top 0.152: U3.17 20.05,14.73 18.85,13.53 RN4.2
FEED  (via drill 0.45)
  Top 0.254: R13.2 213.05,19.77 213.63,20.34 U5.4 214.96,22.1 R9.1 v213.18,22.56 | v220.42,21.04 221.3,21.04 C17.2
  Bottom 0.254: v213.18,22.56 213.18,21.93 214.07,21.04 v220.42,21.04
G  (via drill 0.35)
  Top 0.152: v19.89,11.11 16.33,11.11 15.56,11.89 RN4.8
  Bottom 0.152: v19.89,11.11 21.14,11.11 29.92,19.9 D101.10
G2
  Top 0.152: U3.18 20.17,14.08 18.81,12.73 RN4.1
GND  (via drill 0.3, 0.35, 0.45)
  Top 0.152: 30.65,14.73 C10.2 | J5.12 97.72,22.95 96.59,22.95 v96.34,23.2 96.59,23.45 97.73,23.45 J5.11
  Top 0.254: U27.8 147.2,21.98 C25.1 | R11.1 215.59,12.91 v215.21,13.29 214.96,13.55 U5.5 | R18.1 102.59,9.43 | 151.98,2.04 R83.1 | C4.2 114.02,13.78 v112.98,14.82 112.47,15.33 112.47,15.94 U16.P$47 114.37,17.84 v114.37,17.87 | U16.P$63 122.02,20.66 122.93,20.66 | v106.92,24.94 107.47,25.49 108,25.49 U16.P$31 109.68,23.81 v109.68,23.71 | C20.1 U$6.4 205.41,16.88 205.69,16.6 v206.32,16.6 209.61,16.6 C21.2 v210.26,16.09 | 110.54,32.62 C7.2 v108.41,33.61 | 110.54,32.62 110.44,32.73 110.44,33.67 111.61,34.85 R1.1 | 110.54,32.62 112.34,30.82 112.34,30.31 113.22,29.44 U16.P$18 113.89,28.79 v115.01,28.79 | v121.49,32.85 C5.2 120.62,30.72 119.58,29.68 119.07,29.68 117.84,28.44 U16.P$12 117.11,27.65 v116.28,27.65 | v121.49,32.85 | U3.5 30,15.38 C10.2 | J10.12 125.9,6.44 | 125.9,6.44 125.9,9.33 | J10.11 125.4,5.94 125.9,6.44 | J5.11 99.01,23.48 | J5.12 98.51,22.98 99.01,23.48 | 99.01,23.48 104.14,23.48 C3.2 | S2.2 81.02,35.02 R16.1
  Top 0.381: C10.2 28.47,14.7 U3.4 | C16.2 26.35,19.91 v26.36,19.9 | C12.2 C11.2 | U17.1 114.12,8.89 v114.12,10.5 | C22.2 106.23,7.46 v104.98,8.72 104.21,9.48 R18.1 102.69,9.45 102.69,8.59 102.31,8.21 v101.55,8.21 | v93.42,8.21 92.66,8.21 92.28,8.59 92.28,9.45 R17.1 92.32,10.28 92.66,10.63 96.98,10.63 97.74,11.39 D1.2
  Top 0.508: C2.2 125.94,33.49 v127.71,33.49 v129.23,33.49 v130.76,33.49 v130.76,31.96 v130.76,29.93 v130.76,28.41 v129.23,28.41 v127.71,28.41 125.94,28.41 C1.2 | 92.97,6.78 J8.S$1 | 101.99,6.78 J8.S$2 | J8.P$1 94.28,7.86 93.93,8.21 v93.42,8.21 | J8.P$12 100.68,7.86 101.04,8.21 v101.55,8.21 | TP_GND.1 v171.14,1.99 171.09,2.04 D3.1 165.86,2.04 v165.81,1.99 165.76,2.04 D4.1 162.96,1.99 v160.09,1.99 160.04,2.04 D5.1 157.03,1.9 R83.1 R2.1 141.76,1.9 R21.1 R6.1 | C6.2 C3.2 v103.45,22.44 | J3.4 72.87,15.6 v71.45,14.18 | J4.6 46.81,20.03 v46.81,18.12 | J1.4 141.63,27.47 v141.17,27.01 | J2.8 163.65,24.47 v163.27,24.09 | v175.21,33.99 175.19,33.97 D6.1 175.19,30.97 v175.21,30.95 | U27.8 144.98,20.41 143.71,19.14 U27.2 v140.66,19.14 139,19.14 C38.1 C39.1 | C15.1 v220.29,22.56 | R14.2 v155.9,11.47 | R12.2 v161.75,11.39 | R8.2 v167.33,11.52 | C34.1 v137.23,15.45 | v97.99,30.95 97.98,30.96 C19.2 C18.2 97.98,35.38 v97.99,35.39 | v131.77,39.33 C14.2 130.77,40.74 S1.4 S1.3 | 125.9,9.33 C26.2 C27.2 126.44,11.53 v126.44,12.41 | R19.1 88.34,25.02 v88.34,26.12 | R20.1 v116.15,38.44 | v103.45,22.44 | C11.2 v23.95,10.63 | 122.93,20.66 C9.2 C28.2 C13.2 127.84,25.57 v127.84,25.61 | C10.2 31.81,14.7 v31.82,14.69 | J11.8 71.17,23.61 v71.19,23.58 | U17.1 115.49,8.87 v115.52,8.85 115.63,8.96 C29.2
  Bottom 0.508: U6.3 222.87,27.05 v222.83,27.01 | U4.3 224.21,20.26 v224.23,20.28 | U2.3 222.75,11.05 v222.71,11.01 | U1.3 224.16,3.01 v222.71,3.01 | U8.3 198.87,11.05 v198.83,11.01 | U7.3 198.87,3.05 v198.83,3.01 | U9.3 200.16,19.01 v198.83,19.01 | U10.3 198.74,27.05 v198.7,27.01 | U12.3 32.76,3.05 v32.71,3.01 | U13.3 33.02,9.86 v32.97,9.86 | U14.3 33.09,17.94 v33.09,17.87 | U15.3 32.75,27.05 v32.71,27.01
  other vias: 92.28,4.15 94.94,2.12 97.61,2.12 100.15,2.12 102.56,4.28 22.81,9.61 190.96,22.95 178.38,24.72 64.97,14.44 66.75,11.49 66.75,12.68 66.75,14.06 116.89,25.71 114.76,19.26 114.37,20.28 113.61,19.52 112.72,18.88 110.06,22.31 110.82,23.07 109.04,22.56 118.31,24.85 118.31,23.71 118.31,22.56 119.96,23.45 119.96,24.6 121.11,23.45 112.98,27.26 122.5,4.28 121.36,4.28 83.77,25.23 79.2,25.87 78.81,22.06 81.86,25.87 78.05,23.33 123.01,18.25 122.12,19.01 117.93,14.95 118.69,14.18 117.93,13.42 123.77,19.01 125.68,21.55 124.92,20.79 119.45,28.91 120.22,28.15 197.56,34.12 200.61,35.65 117.93,31.96 116.53,32.98 115.52,33.99 114.37,35.01 112.72,13.17 113.36,12.41 111.96,13.93 111.2,13.17 111.96,12.41 110.44,12.41 113.36,23.71 123.65,4.28 124.79,4.28 125.93,4.28 114.12,27.26 124.66,16.98 125.8,18.12 125.8,15.83 126.95,16.98 128.47,15.45 130.38,15.45 132.28,15.45 134.19,15.45 134.19,17.36 134.19,19.64 128.09,20.41 130,20.41 128.09,22.31 83.51,10.12 85.42,10.12 87.32,10.12 89.23,10.12 83.51,8.21 85.42,8.21 87.32,8.21 89.23,8.21 83.51,6.31 85.42,6.31 87.32,6.31 89.23,6.31 83.51,4.4 85.42,4.4 87.32,4.4 89.23,4.4 83.51,2.5 85.42,2.5 87.32,2.5 89.23,2.5 78.56,20.79 79.7,20.79 80.85,20.79 79.7,19.64 80.85,19.64 80.85,18.5 81.99,18.5 81.99,17.36 83.13,17.36 84.28,17.36 101.42,21.93 100.28,21.93 99.13,21.93 97.99,21.93 96.85,21.93 99.52,24.98 100.66,24.98 101.8,24.98 150.19,15.45 148.66,15.45 147.14,15.45 145.62,15.45 131.9,20.41 166.19,16.22 167.33,16.22 168.48,16.22 119.33,9.36 120.47,9.36 119.33,8.21 120.47,8.21 126.57,7.07 127.71,7.07 128.85,7.07 94.94,28.03 94.94,26.88 94.94,25.74 94.94,24.6 26.36,10.88 27.51,10.88 28.65,10.88 29.79,10.88 26.36,9.74 27.51,9.74 28.65,9.74 29.79,9.74 24.46,12.79 25.6,12.79 25.6,13.93 26.74,12.79 26.74,13.93 26.74,15.07 22.55,16.6 22.55,17.74 23.7,17.74 24.84,18.88 23.7,18.88 22.55,18.88 153.62,19.64 153.62,20.79 153.62,21.93 147.14,23.45 148.28,23.45 149.43,23.45 150.57,23.45 151.71,23.45 152.86,22.69 140.66,24.6 141.81,24.6 141.81,23.45 142.95,22.31 142.95,23.45 142.95,24.6 141.81,22.31 140.66,23.45 139.52,24.6 131.52,5.17 131.52,6.31 132.66,5.17 132.66,6.31 133.81,5.17 133.81,6.31 128.85,26.12 128.85,27.26 130,26.12 130,27.26 138.38,25.74 138.38,26.88 138.38,24.6 139.52,25.74 103.71,26.5 102.82,25.61 102.18,27.26 157.81,18.12 156.28,18.12 160.48,16.98 98.5,14.06 97.36,14.06 96.21,14.06 95.07,14.06 93.93,14.06 92.78,14.06 91.64,14.06 90.5,14.06 89.36,14.06 115.39,36.41 116.53,36.41 117.68,35.27 117.68,34.12 117.68,36.41 116.53,35.27
  pour Top (no thermals): 176.86,27.52 180.16,27.52 180.16,23.33 179.78,22.95 179.78,21.68 179.14,21.04 178.13,21.04 177.37,21.8 177.37,22.95 176.86,23.45
  pour Top (no thermals): 189.3,25.74 192.61,25.74 192.61,21.55 192.23,21.17 192.23,19.9 191.59,19.26 190.57,19.26 189.81,20.02 189.81,21.17 189.3,21.68
  pour Top (no thermals): 128.73,30.69 130.76,30.69 130.76,28.41 128.73,28.41
  pour Top (no thermals): 128.22,31.33 128.22,33.49 127.07,33.49 127.07,31.33
  pour Top (no thermals): 93.42,7.2 93.42,5.17 94.31,4.28 100.66,4.28 101.55,5.17 101.55,7.07 101.67,7.2 103.58,7.2 103.71,7.07 103.71,1.23 103.45,0.97 91.51,0.97 91.26,1.23 91.26,7.07 91.39,7.2
  pour Route2: 130,57.49 257,57.49 257,4.15 257,2.88 3,2.88 3,57.49
  pour Bottom: -5.89,52.79 -5.89,-6.9 253.19,-6.9 253.19,52.79
  cutout Top: 89.86,30.82 92.15,30.82 92.15,19.77 89.86,19.77
  cutout Top: 89.86,44.16 89.86,41.49 92.15,41.49 92.15,44.16
  pour Top (rank 2): -3.35,50.12 250.39,50.12 250.39,-4.36 -3.35,-4.36
GND1
  cutout Bottom: 89.86,30.82 92.15,30.82 92.15,19.77 89.86,19.77
GND2
  cutout Bottom: 89.86,44.16 89.86,41.49 92.15,41.49 92.15,44.16
HORNB  (via drill 0.4)
  Top 0.254: U5.6 216.23,16.09 215.17,17.14 R13.1 v213.05,12.53
  Bottom 0.254: v213.05,12.53 213.05,7.82 LS100.G
HORNS
  Top 0.254: U5.7 217.5,16.85 218.39,17.74 221.18,17.74 | 221.18,17.74 LS100.M | 221.18,17.74 221.94,18.5 C17.1
INERTIA  (via drill 0.45)
  Top 0.152: D3.2 INERTIA.1
  Top 0.254: INERTIA.1 169.11,9.61 169.87,10.37 R3.1 170.89,13.84 170.89,16.34 169.62,17.61 162.89,17.61 v158.82,21.68 | J2.6 157.2,26.49 157.2,23.3 v157.3,23.2
  Bottom 0.254: v158.82,21.68 v157.3,23.2
INERTIA_READ  (via drill 0.3)
  Top 0.152: U16.P$59 120.85,19 121.23,19 125.67,14.56 150.7,14.56 153.6,17.47 158.33,17.47 v158.7,17.1 | v166.06,14.56 167.29,14.56 R8.1
  Top 0.254: R3.2 R8.1
  Bottom 0.152: v158.7,17.1 160.09,15.71 164.92,15.71 v166.06,14.56
LEFT_SHIFTER
  Top 0.152: U16.P$43 107.26,13.55 100.15,13.55 99.01,14.69 88.75,14.69 87.73,13.67 79.73,13.67 79.32,13.27 77.61,13.27 J3.1
MCU_BOOT_0  (via drill 0.3, 0.35)
  Top 0.152: v119.2,21.42 120.31,20.31 U16.P$60 | v83.64,32.98 83.59,33.03 R16.2
  Top 0.254: S2.COM 83.59,38.23 R16.2
  Bottom 0.152: v83.64,32.98 113.36,32.98 119.2,27.14 v119.2,21.42
MCU_CAN_1_RX
  Top 0.152: U16.P$61 121.61,19.65 125.93,19.65 127.46,18.12 134.94,18.12 136.73,16.34 141.74,16.34 U27.4
MCU_CAN_1_TX
  Top 0.152: U16.P$62 121.82,20.15 126.31,20.15 127.71,18.75 134.95,18.75 136.85,20.66 141.74,20.66 U27.1
MCU_LED
  Top 0.254: U16.P$17 113.6,29.84 MCU_LED.2
MCU_NEOPIXEL  (via drill 0.3)
  Top 0.152: U16.P$3 121.66,25.83 121.66,26.23 v121.96,26.53 | 202.64,17.99 200.35,17.99 199.59,18.75 199.59,35.52 | NEOPIXELS.1 200.35,34.76 199.59,35.52 | v198.58,35.77 199.34,35.77 199.59,35.52
  Top 0.254: U$6.2 204.67,18.24 204.42,17.99 202.64,17.99
  Bottom 0.152: v121.96,26.53 122.53,27.1 122.92,27.1 124.41,28.58 124.41,37.17 132.02,44.78 135.28,44.78 198.07,35.92 v198.58,35.77
MCU_NRST
  Top 0.152: U16.P$7 120.98,27.98 120.98,29.3 122.76,31.07 122.76,35.01 119.96,37.8 119.96,41.32 R7.1 | C14.1 131.77,43.27 131.17,43.87 S1.2
  Top 0.254: S1.2 S1.1 120.22,43.87 R7.1
MCU_OSC_IN
  Top 0.152: U16.P$5 121.8,27.39 122.9,27.39 C1.1 127.4,30.17 X1.1
MCU_OSC_OUT
  Top 0.152: U16.P$6 R15.2
MCU_SPI1_MOSI  (via drill 0.35)
  Top 0.152: U16.P$23 110.23,28.91 100.93,28.91 | 100.93,28.91 98.99,26.98 J5.4 | 100.93,28.91 100.02,28.91 v99.77,28.66 | v92.78,32.14 SPI1_MOSI.1
  Bottom 0.152: v99.77,28.66 95.71,28.66 92.78,31.58 v92.78,32.14
MCU_SPI1_SCK
  Top 0.152: U16.P$21 110.75,29.8 107.14,29.8 | 107.14,29.8 100.02,29.8 97.76,27.54 J5.3 | 107.14,29.8 104.6,32.34 SPI1_SCK.1
MCU_SPI2_MISO  (via drill 0.3, 0.35)
  Top 0.152: U3.3 29.64,14.08 30.43,13.29 65.61,13.29 65.62,13.31 v65.73,13.31 | U16.P$10 117.91,27.03 117.47,27.03 v117.25,26.8
  Bottom 0.152: v117.25,26.8 117.12,26.8 116.28,25.96 116.28,25.5 104.21,13.43 65.86,13.43 v65.73,13.31
MCU_SPI2_MOSI  (via drill 0.3, 0.35)
  Top 0.152: U3.2 29.53,13.43 30.81,12.15 65.34,12.15 65.4,12.09 v65.73,12.09 | U16.P$9 118.26,26.68 118.26,26.24 v118.03,26.02
  Bottom 0.152: v118.03,26.02 117.12,25.11 116.53,25.11 104.14,12.71 68.78,12.71 68.17,12.09 v65.73,12.09
MCU_SPI2_SCK  (via drill 0.3)
  Top 0.152: U3.1 29.29,12.78 31.19,10.88 v65.73,10.88 | U16.P$29 112.34,22.56 112.34,21.68 v113.36,20.66
  Bottom 0.152: v113.36,20.66 113.1,20.66 104.47,12.02 71.58,12.02 70.43,10.88 v65.73,10.88
MCU_SPI3_MOSI  (via drill 0.3, 0.45)
  Top 0.152: U16.P$26 111.41,25.61 114.76,25.61 115.77,24.6 115.77,21.68 v115.64,21.55 | v121.87,8.98 121.87,5.47 J10.4 | v129.36,9.86 131.27,9.86 SPI3_MOSI.1
  Bottom 0.152: v115.64,21.55 115.64,19.14 121.87,12.91 v121.87,8.98 121.87,8.47 122.38,7.96 128.73,7.96 129.36,8.59 v129.36,9.86
MCU_SPI3_SCK
  Top 0.152: J10.3 121.4,5.99 121.06,6.33 121.06,10.12 | U16.P$51 121.06,13.14 121.06,10.12 | SPI3_SCK.1 119.79,11.39 121.06,10.12
MCU_USB_N
  Top 0.198: U16.P$44 111.48,17.06 111.48,16.94 107.57,13.04 97.46,13.04 96.79,12.36 D1.3
MCU_USB_P
  Top 0.198: U16.P$45 111.83,16.71 111.71,16.71 107.71,12.72 99.88,12.72 99.23,12.06 D1.1
N$1
  Bottom 0.254: U12.4 36.52,3.93 36.52,2.25 37.41,1.36 106.5,1.36 108.15,3.01 196.29,3.01 197.43,4.15 197.43,30.69 198.58,31.84 202,31.84 202.51,31.33 202.51,29.3 204.76,27.05 U10.2
N$4
  Bottom 0.254: U8.2 202.64,13.32 202.64,18.25 201.62,19.26 201.62,20.83 U9.4
N$5
  Bottom 0.254: U2.4 226.52,11.94 226.52,5.44 U1.2
N$6
  Bottom 0.254: U4.4 226.52,19.94 226.52,13.44 U2.2
N$7
  Bottom 0.254: U6.4 226.64,27.81 226.64,21.31 U4.2
N$8
  Bottom 0.254: U7.4 202.51,3.94 202.51,1.86 203.4,0.97 211.66,0.97 221.69,11.01 221.69,31.33 222.45,32.09 225.75,32.09 226.52,31.33 226.52,29.44 U6.2
N$10  (via drill 0.4)
  Top 0.254: U$6.7 209.37,18.24 209.62,17.99 211.28,17.99 211.78,17.48 211.78,12.02 217.5,6.31 v222.2,6.31
  Bottom 0.254: v222.2,6.31 224.15,6.31 U1.4
N$11
  Top 0.254: MCU_LED.1 114.05,32.67 R1.2
N$12
  Bottom 0.254: U15.4 36.52,27.93 36.52,21.43 U14.2
N$16
  Top 0.254: J7.3 115.6,41.75 R20.2 116.1,41.25 J7.4
N$17
  Top 0.254: J9.3 86.05,24.43 R19.2 86.55,24.93 J9.4
N$20
  Bottom 0.254: U14.4 36.52,19.93 36.52,13.43 U13.2
N$21  (via drill 0.35)
  Top 0.152: R36.1 151.84,19.39 152.22,19.01 v152.22,18.5 152.22,18.12 151.84,17.74 R60.1 | C25.2 151.59,22.06 v151.97,21.68
  Bottom 0.152: v151.97,21.68 152.22,21.42 v152.22,18.5
N$23
  Bottom 0.254: U9.2 203.47,20.48 203.47,20.49 202.64,21.32 202.64,27.82 U10.4
N$26
  Bottom 0.254: U8.4 202.51,11.94 202.51,5.44 U7.2
N$27
  Bottom 0.254: U12.2 36.65,5.31 36.65,11.81 U13.4
N$28
  Top 0.254: R17.2 95.45,9.48 96.23,8.7 J8.P$4
N$31
  Top 0.152: 3V3.1 136.6,3.55 R6.2
N$32
  Top 0.152: 5V.1 R21.2
N$33
  Top 0.152: R2.2 12V.1
N$35
  Top 0.254: R18.2 100.02,9.48 99.23,8.69 J8.P$10
N$38
  Top 0.152: 24V.1 R83.2
N$54
  Top 0.254: R9.2 216.19,30.1 214.39,31.9 LS100.F
RIGHT_SHIFTER
  Top 0.152: U16.P$42 107.03,14.03 100.55,14.03 99.39,15.2 88.34,15.2 87.32,14.18 79.45,14.18 79.07,13.8 74.32,13.8 72.87,12.35 J3.2
SHARP_CS  (via drill 0.3)
  Top 0.152: J5.5 97.78,26.5 100.28,26.5 101.93,28.15 110.28,28.15 U16.P$24 111.81,26.63 115.01,26.63 117.37,24.26 117.37,21.65 v116.49,20.76 | J10.5 122.4,8.72 122.42,8.75 v122.42,9.92
  Bottom 0.152: v116.49,20.76 116.51,20.74 116.51,19.4 122.42,13.48 v122.42,9.92
SHARP_EXTMODE  (via drill 0.3)
  Top 0.152: v115.01,22.56 115.01,24.6 114.5,25.11 111.21,25.11 U16.P$27 109.56,26.76 104.98,26.76 102.2,23.98 J5.10 | v125.17,12.02 125.17,8.59 124.9,8.32 J10.10
  Bottom 0.152: v125.17,12.02 125.17,14.31 116.91,22.56 v115.01,22.56
SHARP_VCOMM  (via drill 0.3)
  Top 0.152: J5.6 97.78,26 97.8,25.98 102.07,25.98 103.48,27.39 110.34,27.39 U16.P$25 110.77,26.92 111.54,26.15 114.87,26.15 116.56,24.46 116.56,22.08 v116.71,21.93 | J10.6 122.9,8.89 v123,8.99
  Bottom 0.152: v123,8.99 123,14.07 117.42,19.64 117.42,20.86 116.71,21.58 v116.71,21.93
USB_N
  Top 0.198: D1.4 96.73,9.39 J8.P$5 96.72,6.77 96.72,5.93 96.98,5.67 97.48,5.67 97.73,5.92 J8.P$7
USB_P
  Top 0.198: D1.6 98.69,8.28 98.5,8.09 | J8.P$8 98.23,7.82 98.5,8.09 | 98.5,8.09 97.48,8.09 97.23,7.83 J8.P$6
VCAP_1
  Top 0.254: U16.P$30 108.2,25.99 107.01,25.99 C3.1
XTAL_IN
  Top 0.152: R15.1 125.44,31.72 C2.1 126.27,31.72 126.98,31.02 128.55,31.02 129.27,31.74 X1.3

## Text on the board
tNames: FLASH | BOOT | TTPMS | DIAL | CAN/ / SHUTDOWN | BUTTONS | SHIFTERS | Dashboard rev. 7 / Designed by Walker Burns / and Ivan Mix
bNames: PACK | AMS | BRAKE | GLV | IMD | TORQUE | INERTIA | MCU | LAUNCH | BRB | DRIVE | BOTS